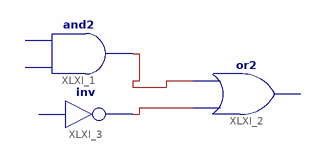
[diagram p0: schematic sheet 1]
// Xilinx ISE schematic ejercicio1.sch (spartan3e) as structural Verilog: 3 symbols, 0 ports
module ejercicio1 (
);

  wire XLXN_4, XLXN_6;

  // and2 XLXI_1 has open pins: I0=open, I1=open, O=XLXN_4
  // or2 XLXI_2 has open pins: I0=XLXN_6, I1=XLXN_4, O=open
  // inv XLXI_3 has open pins: I=open, O=XLXN_6
endmodule
